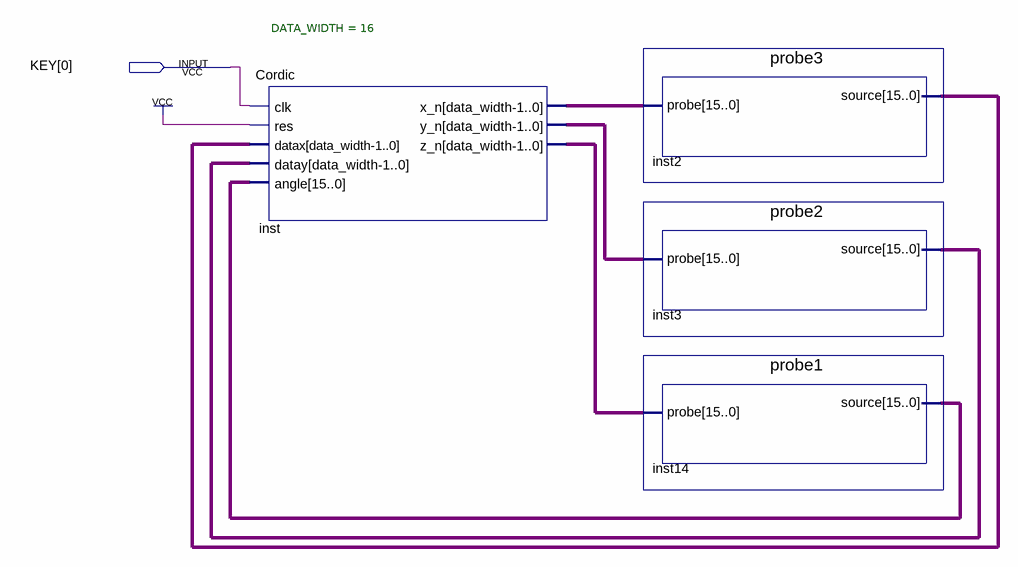
[diagram p0: schematic sheet]
// Quartus schematic task2.bdf as structural Verilog: 4 symbols, 1 pins
module task2 (
  input  [0:0] KEY
);

  wire [15:0] inst2_source, inst3_source, inst14_source, inst_x_n, inst_y_n, inst_z_n;

  Cordic #(.DATA_WIDTH(16)) inst (
    .clk(KEY[0]), .res(1'b1), .datax(inst2_source), .datay(inst3_source), .angle(inst14_source),
    .x_n(inst_x_n), .y_n(inst_y_n), .z_n(inst_z_n));
  probe3 inst2 (.probe(inst_x_n), .source(inst2_source));
  probe2 inst3 (.probe(inst_y_n), .source(inst3_source));
  probe1 inst14 (.probe(inst_z_n), .source(inst14_source));
endmodule
